# EasyEDA Pro project ProPrj_Volt_Meter_25_3_25_2025-04-11.epro

# Schematic Schematic1

## Sheets
1 P1: Board Name: Board1; Create Date: 2025-03-25; Page Name: P1; Project Name: Volt_Meter_25_3_25; Schematic Name: Schematic1; Update Date: 2025-04-11; Company: 嘉立创EDA; Page Size: A4; Version: V1.0
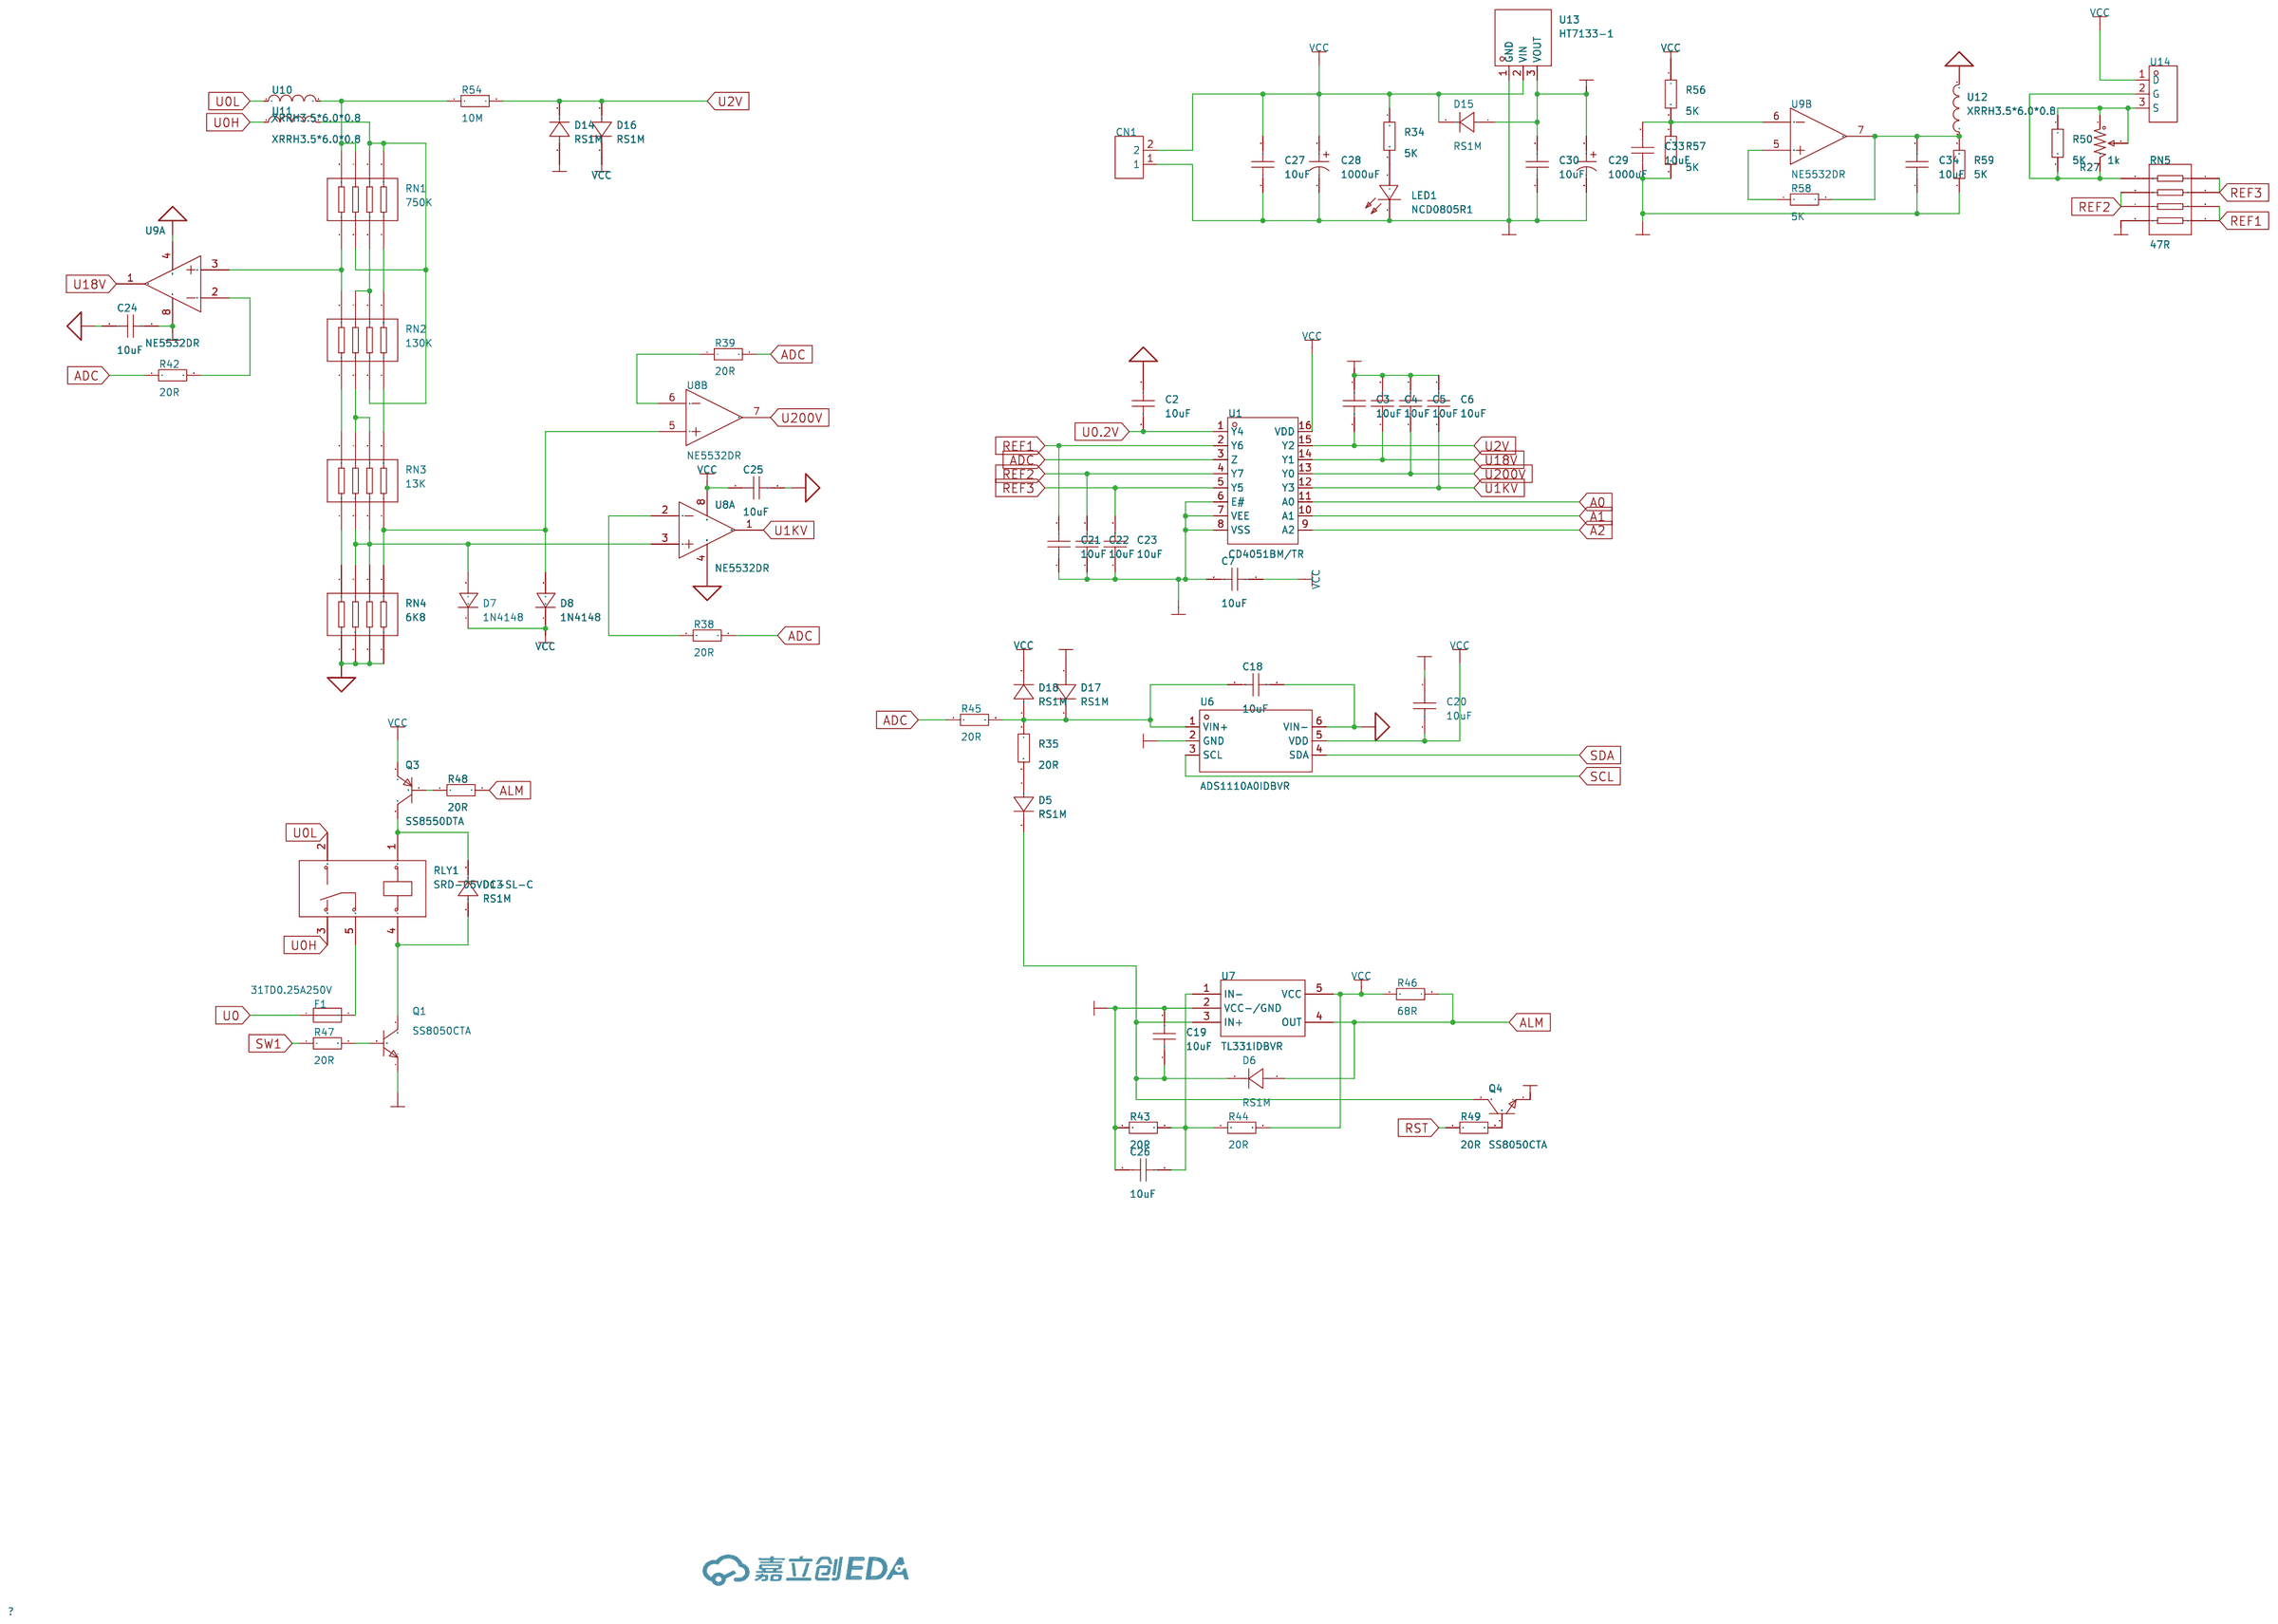
[diagram p0: P1]
2 P2: Page Name: P2; Update Date: 2025-03-26
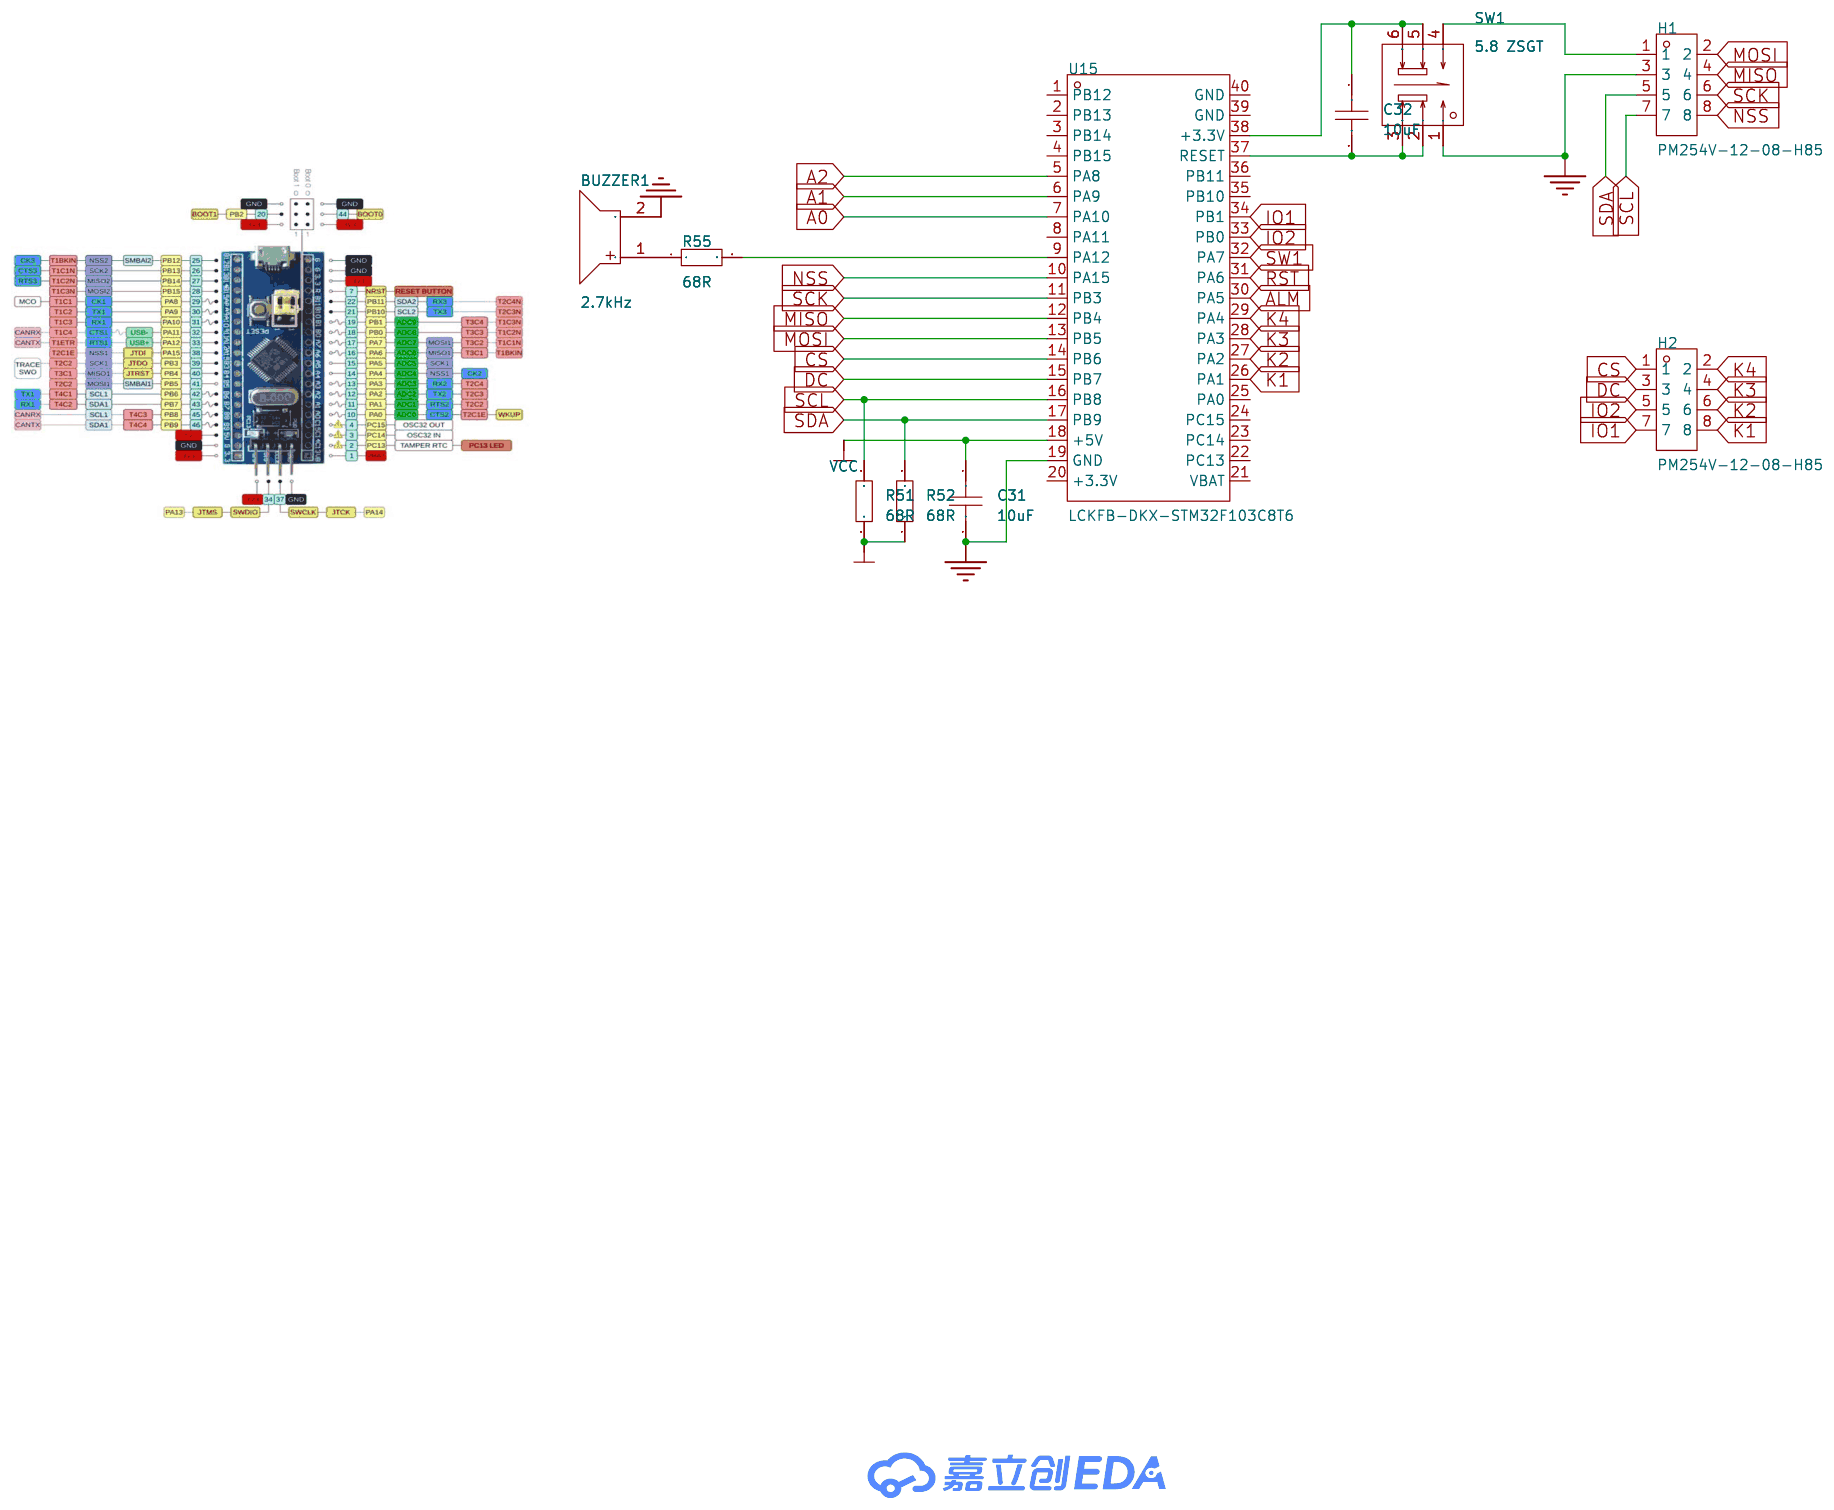
[diagram p1: P2]

## Parts
sheet P1
C2  10uF  [C1206]
C3  10uF  [C1206]
C4  10uF  [C1206]
C5  10uF  [C1206]
C6  10uF  [C1206]
C7  10uF  [C1206]
C18  10uF  [C1206]
C19  10uF  [C1206]
C20  10uF  [C1206]
C21  10uF  [C1206]
C22  10uF  [C1206]
C23  10uF  [C1206]
C24  10uF  [C1206]
C25  10uF  [C1206]
C26  10uF  [C1206]
C27  10uF  [C1206]
C28  1000uF  [CAP-TH_BD10.0-P5.00-D0.6-FD]
C29  1000uF  [CAP-TH_BD10.0-P5.00-D0.6-FD]
C30  10uF  [C1206]
C33  10uF  [C1206]
C34  10uF  [C1206]
CN1  WAFER-XH254Z-2A  [CONN-TH_2P-P2.50_XH-2A_3045048]
D5  RS1M  [SMA_L4.3-W2.6-LS5.2-FD]
D6  RS1M  [SMA_L4.3-W2.6-LS5.2-FD]
D7  1N4148  [DO-35_BD2.0-L4.2-P8.20-D0.5-RD]
D8  1N4148  [DO-35_BD2.0-L4.2-P8.20-D0.5-RD]
D13  RS1M  [SMA_L4.3-W2.6-LS5.2-FD]
D14  RS1M  [SMA_L4.3-W2.6-LS5.2-FD]
D15  RS1M  [SMA_L4.3-W2.6-LS5.2-FD]
D16  RS1M  [SMA_L4.3-W2.6-LS5.2-FD]
D17  RS1M  [SMA_L4.3-W2.6-LS5.2-FD]
D18  RS1M  [SMA_L4.3-W2.6-LS5.2-FD]
F1  31TD0.25A250V  [FUSE-TH_BD4.0-L11.0-P15.00-D0.6]
LED1  NCD0805R1  [LED0805-R-RD]
Q1  SS8050CTA  [TO-92-3_L4.8-W3.7-P2.54-L]
Q3  SS8550DTA  [TO-92-3_L4.8-W3.7-P2.54-L]
Q4  SS8050CTA  [TO-92-3_L4.8-W3.7-P2.54-L]
R27  1k  [rp]
R34  5K  [R1206]
R35  20R  [R1206]
R38  20R  [R1206]
R39  20R  [R1206]
R42  20R  [R1206]
R43  20R  [R1206]
R44  20R  [R1206]
R45  20R  [R1206]
R46  68R  [R1206]
R47  20R  [R1206]
R48  20R  [R1206]
R49  20R  [R1206]
R50  5K  [R1206]
R54  10M  [RES-TH_BD3.3-L9.0-P13.00-D0.6]
R56  5K  [R1206]
R57  5K  [R1206]
R58  5K  [R1206]
R59  5K  [R1206]
RLY1  SRD-05VDC-SL-C  [RELAY-TH_SRD-XXVDC-XL-C]
RN1  750K  [RES-ARRAY-SMD_0603-8P-L3.2-W1.6-BL]
RN2  130K  [RES-ARRAY-SMD_0603-8P-L3.2-W1.6-BL]
RN3  13K  [RES-ARRAY-SMD_0603-8P-L3.2-W1.6-BL]
RN4  6K8  [RES-ARRAY-SMD_0603-8P-L3.2-W1.6-BL]
RN5  47R  [RES-ARRAY-SMD_0603-8P-L3.2-W1.6-BL]
U1  CD4051BM/TR  [SOP-16_L9.9-W3.9-P1.27-LS6.1-BL]
U6  ADS1110A0IDBVR  [SOT-23-6_L2.9-W1.6-P0.95-LS2.8-BR]
U7  TL331IDBVR  [SOT-23-5_L3.0-W1.7-P0.95-LS2.8-BR]
U8  NE5532DR  [SOIC-8_L4.9-W3.9-P1.27-LS6.0-BL]  (sections 1,2)
U9  NE5532DR  [SOIC-8_L4.9-W3.9-P1.27-LS6.0-BL]  (sections 1,2)
U10  XRRH3.5*6.0*0.8  [IND-TH_BD3.5-L6.0-P10.00-D0.8]
U11  XRRH3.5*6.0*0.8  [IND-TH_BD3.5-L6.0-P10.00-D0.8]
U12  XRRH3.5*6.0*0.8  [IND-TH_BD3.5-L6.0-P10.00-D0.8]
U13  HT7133-1  [SOT-89_L4.5-W2.5-P1.50-LS4.2-BR]
U14  J175-D26Z  [TO-92-3_L4.9-W3.7-P2.54-L]
sheet P2
BUZZER1  2.7kHz  [BUZ-TH_BD9.0-P4.00-D0.6-FD]
C31  10uF  [C1206]
C32  10uF  [C1206]
H1  PM254V-12-08-H85  [HDR-TH_8P-P2.54-V-F-R2-C4-S2.54]
H2  PM254V-12-08-H85  [HDR-TH_8P-P2.54-V-F-R2-C4-S2.54]
R51  68R  [R1206]
R52  68R  [R1206]
R55  68R  [R1206]
SW1  5.8 ZSGT  [SW-TH_5.8ZSGT]
U15  LCKFB-DKX-STM32F103C8T6  [CONN-TH_L53.3-W22.9_STM32F103C8T6-CARD]

## Library data of the parts
C2-C7 C18-C23 C26 C27 C30-C34 = HGC1206R5106K500NSPJ: 容值:10uF;精度:±10%;额定电压:50V;温度系数:X5R;; LCSC Part Name: 10uF ±10% 50V; Supplier Part: C7432781; Manufacturer: Chinocera(华瓷); Supplier Footprint: 1206; JLCPCB Part Class: Extended Part; Datasheet: https://atta.szlcsc.com/upload/public/pdf/source/20240320/FAC3FEC40A78BC5CCCE96C232A94D860.pdf; Supplier: LCSC; Tolerance: ±10%; Voltage Rating: 50V; Temperature Coefficient: X5R
C24 C25 = HGC1206R5106K500NSPJ: 容值:10uF;精度:±10%;额定电压:50V;温度系数:X5R;; LCSC Part Name: 10uF ±10% 50V; Supplier Part: C7432781; Manufacturer: Chinocera(华瓷); Supplier Footprint: 1206; JLCPCB Part Class: Extended Part; Datasheet: https://atta.szlcsc.com/upload/public/pdf/source/20240320/FAC3FEC40A78BC5CCCE96C232A94D860.pdf; Supplier: LCSC; Tolerance: ±10%; Voltage Rating: 50V; Temperature Coefficient: X5R; Voltage Rated: 50V
C28 C29 = CD288108M1V1020VFL: 容值:1000uF;额定电压:35V;; LCSC Part Name: 1000uF 35V; Supplier Part: C7499950; Manufacturer: HRK(鸿瑞凯); Supplier Footprint: 插件,D10xL20mm; JLCPCB Part Class: 扩展库; Supplier: LCSC; Rated Voltage: 35V; φD: 10mm; L: 20mm
CN1 = WAFER-XH254Z-2A: 插针结构:1x2P;间距:2.54mm;安装方式:直插;参考系列:XH;总PIN数:2P;排数:1;每排PIN数:2;额定电流:3A;工作温度范围:-25℃~+85℃;; Supplier Part: C7432682; Manufacturer: HANBO(汉博); Supplier Footprint: 插件,P=2.5mm; JLCPCB Part Class: 扩展库; Datasheet: https://atta.szlcsc.com/upload/public/pdf/source/20230718/3B4FABA5D38EFB02DAF74E7C2B33D98F.pdf; Supplier: LCSC; Pins Structure: 1x2P; Pitch: 2.54mm; Mounting Style: 直插; Reference Series: XH; Number of Pins: 2P; Number of Rows: 1; Number of PINs Per Row: 2; Current Rating (Max): 3A; Operating Temperature Range: -25℃~+85℃
D5 D6 D13-D18 = RS1M_C84573: 二极管配置:-;正向压降(Vf):1.3V@1A;直流反向耐压(Vr):1kV;平均整流电流(Io):1A;反向恢复时间(trr):500ns;; LCSC Part Name: 电压:1kV 电流:1A; Supplier Part: C84573; Manufacturer: onsemi(安森美); Supplier Footprint: SMA(DO-214AC); JLCPCB Part Class: Extended Part; Datasheet: https://atta.szlcsc.com/upload/public/pdf/source/20221020/37CD5E236AEBE8986458C591B9789D62.pdf; Supplier: LCSC; Forward Voltage (Vf@If): 1.3V@1A; Reverse Voltage (Vr): 1kV; Average Rectified Current (Io): 1A; Reverse Leakage Current: 5uA@1kV; Reverse Recovery Time (trr): 500ns; Operating Temperature: -55℃~+150℃
D7 D8 = 1N4148_C402212: 二极管配置:-;正向压降(Vf):1V@10mA;直流反向耐压(Vr):75V;整流电流:150mA;反向恢复时间(Trr):4ns;; Supplier Part: C402212; Manufacturer: LGE(鲁光); Supplier Footprint: DO-35; JLCPCB Part Class: 扩展库; Datasheet: https://atta.szlcsc.com/upload/public/pdf/source/20190705/C402212_D6CD0A8EA8714742E0940C7C02C37BFA.pdf; Supplier: LCSC; Voltage - Forward(Vf@If): 1V@10mA; Voltage - DC Reverse(Vr): 75V; Current - Rectified: 150mA; Reverse Leakage Current (Ir): 5uA@75V; Reverse Recovery Time (trr): 4ns
F1 = 31TD3.15A250V: 类型:玻璃管保险丝;额定电流:3.15A;; LCSC Part Name: 玻璃管保险丝; Supplier Part: C529611; Manufacturer: Hongda(泓达); Supplier Footprint: 插件,3.6x10mm; JLCPCB Part Class: 扩展库; Datasheet: https://atta.szlcsc.com/upload/public/pdf/source/20200925/C529598_C15F8C787D72EA14793E531535459612.pdf; Supplier: LCSC; Type: 玻璃管保险丝; Current Rating: 3.15A
LED1 = NCD0805R1: 灯头类型:-;发光颜色:红色;正向电压(VF):1.6V~2.6V;功率:65mW;正向电流:20mA;主波长:615nm~630nm;二极管配置:独立二极管;透镜颜色:无色透明透镜;色温:-;发光强度:67mcd~195mcd;发光角度:130°;载带方式:-;工作温度:-30℃~+85℃;; Supplier Part: C84256; Manufacturer: 国星光电; Supplier Footprint: 0805; JLCPCB Part Class: 基础库; Datasheet: https://atta.szlcsc.com/upload/public/pdf/source/20200820/C84256_F0A75A43B3EAD75808600A0514C76B99.pdf; Supplier: LCSC; Emitted Color: 红色; Forward Voltage (VF): 1.6V~2.6V; Power Dissipation: 65mW; Forward Current: 20mA; Dominant Wavelength: 615nm~630nm; Diode Configuration: 独立二极管; Lens Color: 无色透明透镜; Luminous Intensity: 67mcd~195mcd; Viewing Angle: 130°; Operating Temperature: -30℃~+85℃
Q1 Q4 = SS8050CTA: 晶体管类型:NPN;集电极电流(Ic):1.5A;集射极击穿电压(Vceo):25V;功率(Pd):1W;直流电流增益(hFE@Ic,Vce):45@5mA,1V;; LCSC Part Name: NPN 电流:1.5A 耐压:25V; Supplier Part: C327517; Manufacturer: onsemi(安森美); Supplier Footprint: TO-92-3; JLCPCB Part Class: Extended Part; Datasheet: https://atta.szlcsc.com/upload/public/pdf/source/20181108/C327517_CA6FA84C2D2031BB33923FFD20F34E98.pdf; Supplier: LCSC; Transistor Type: NPN; Collector Current (Ic): 1.5A; Collector-Emitter Breakdown Voltage (Vceo): 25V; Power Dissipation (Pd): 1W; DC Current Gain (hFE@Ic,Vce): 45@5mA,1V; Transition Frequency (fT): 100MHz; Collector Cut-Off Current (Icbo): 100nA; Collector-Emitter Saturation Voltage (VCE(sat)@Ic,Ib): 500mV@800mA,80mA; Operating Temperature: -150℃~+150℃
Q3 = SS8550DTA: 晶体管类型:PNP;集电极电流(Ic):1.5A;集射极击穿电压(Vceo):25V;功率(Pd):2W;直流电流增益(hFE@Ic,Vce):40@800mA,1V;; LCSC Part Name: PNP 电流:1.5A 耐压:25V; Supplier Part: C903228; Manufacturer: onsemi(安森美); Supplier Footprint: TO-92-3; JLCPCB Part Class: Extended Part; Datasheet: https://atta.szlcsc.com/upload/public/pdf/source/20221020/9DBCD1C6A257D06DE4F9043ED0140297.pdf; Supplier: LCSC; Transistor Type: PNP; Collector Current (Ic): 1.5A; Collector-Emitter Breakdown Voltage (Vceo): 25V; Power Dissipation (Pd): 2W; DC Current Gain (hFE@Ic,Vce): 40@800mA,1V; Transition Frequency (fT): 100MHz; Collector Cut-Off Current (Icbo): 100nA; Collector-Emitter Saturation Voltage (VCE(sat)@Ic,Ib): 280mV@800mA,80mA; Operating Temperature: -65℃~+150℃
R27 = RM065-103(10K): 阻值:10kΩ;精度:±25%;功率:100mW;; LCSC Part Name: 10kΩ ±25%; Supplier Part: C5205021; Manufacturer: BOCHEN(博晨); Supplier Footprint: 插件; JLCPCB Part Class: 扩展库; Datasheet: https://atta.szlcsc.com/upload/public/pdf/source/20221019/6263C46FBC7F1B66CBAADA74DC5EFAA2.pdf; Supplier: LCSC; Tolerance: ±25%; Power(Watts): 100mW
R34 R35 R38 R39 R42-R52 R55-R59 = 1206W4F4701T5E: 电阻类型:厚膜电阻;阻值:4.7kΩ;精度:±1%;功率:250mW;最大工作电压:200V;温度系数:±100ppm/℃;; LCSC Part Name: 4.7kΩ ±1% 250mW 厚膜电阻; Supplier Part: C17936; Manufacturer: UNI-ROYAL(厚声); Supplier Footprint: 1206; JLCPCB Part Class: 基础库; Datasheet: https://atta.szlcsc.com/upload/public/pdf/source/20200306/C422600_1E6D84923E4A46A82E41ADD87F860B5C.pdf; Supplier: LCSC; Type: 厚膜电阻; Tolerance: ±1%; Power(Watts): 250mW; Overload Voltage (Max): 200V; Temperature Coefficient: ±100ppm/℃; Operating Temperature Range: -55℃~+155℃
R54 = RN1WS15KΩFT/BA1: 电阻类型:金属膜电阻;阻值:15kΩ;精度:±1%;功率:1W;温度系数:±50ppm/℃;; LCSC Part Name: 15kΩ ±1% 1W 金属膜电阻; Supplier Part: C385283; Manufacturer: Tyohm(幸亚电阻); Supplier Footprint: 插件,D3.3xL9.2mm; JLCPCB Part Class: 扩展库; Datasheet: https://atta.szlcsc.com/upload/public/pdf/source/20191008/C433681_B72693A7FD256E0D1DC5EFE3F095EED3.pdf; Supplier: LCSC; Type: 金属膜电阻; Tolerance: ±1%; Power(Watts): 1W; Temperature Coefficient: ±50ppm/℃
RLY1 = SRD-05VDC-SL-C: 线圈电压:5V;触点形式:一组转换:1C(单刀双掷-转换);触点容量(电阻负载):-;最大切换电压:250V@AC;最大切换电流:15A;; LCSC Part Name: 蓝色; Supplier Part: C35449; Manufacturer: 松乐; Supplier Footprint: 插件,15.6x19.2mm; JLCPCB Part Class: 扩展库; Datasheet: https://atta.szlcsc.com/upload/public/pdf/source/20200305/C490149_C96E4098A3B1FFB377D5AD2E40B7C2A8.pdf; Supplier: LCSC; Coil Voltage: 5V; Contact Form: 一组转换:1C(单刀双掷-转换); Pin Number: 5; Maximum Switching Voltage: 250V@AC; Coil Rated Power: 360mW; Maximum Switching Current: 15A; Coil Type: 无极性-单线圈; Coil Resistance: 70Ω; Contact Resistance: 100mΩ; Operate Time: 10ms; Release Time: 10ms
RN1-RN5 = 4D03WGJ0103T5E: 电阻器数:4;阻值:10kΩ;精度:±5%;单个元件功率:62.5mW;温度系数:±200ppm/℃;; LCSC Part Name: 10kΩ ±5%; Supplier Part: C29718; Manufacturer: UNI-ROYAL(厚声); Supplier Footprint: 0603x4; JLCPCB Part Class: Basic Part; Datasheet: https://atta.szlcsc.com/upload/public/pdf/source/20191224/C474318_2527498AE30E813171187CCD28401A71.pdf; Supplier: LCSC; Number of Resistors: 4; Tolerance: ±5%; Power(Watts): 62.5mW; Temperature Coefficient: ±200ppm/℃; Number of Pins: 8
U1 = CD4051BM/TR: 开关电路:单刀八掷(SP8T);通道数:8;导通电阻(Ron@VCC):60Ω;; LCSC Part Name: CD4051B 单刀八掷模拟开关; Supplier Part: C507163; Manufacturer: HGSEMI(华冠); Supplier Footprint: SOP-16; JLCPCB Part Class: Extended Part; Datasheet: https://atta.szlcsc.com/upload/public/pdf/source/20240320/7BB009024CA6631C42E25AC5CB4174DD.pdf; Supplier: LCSC; Switch Circuit: 单刀八掷(SP8T); Number of Channels: 8; Supply Voltage: 3V~15V; On-State Resistance (Max): 60Ω; Operating Temperature: -40℃~+85℃
U6 = ADS1110A0IDBVR: 接口:I2C;电源电压:2.7V~5.5V;采样率:240Hz;分辨率:16位;; Supplier Part: C16598; Manufacturer: TI(德州仪器); Supplier Footprint: SOT-23-6; JLCPCB Part Class: Extended Part; Datasheet: http://www.ti.com/cn/lit/gpn/ads1110; Supplier: LCSC; Interface: I2C; differential input: 是; number of channels: 1; Supply Voltage: 2.7V~5.5V; sampling frequency: 240Hz; resolution: 16位; Operating Temperature: -40℃~+125℃
U7 = TL331IDBVR: 输入失调电压(Vos):5mV;输入偏置电流(Ib):250nA;轨到轨:-;; LCSC Part Name: 单通道差分比较器; Supplier Part: C80942; Manufacturer: TI(德州仪器); Supplier Footprint: SOT-23-5; JLCPCB Part Class: Extended Part; Datasheet: https://www.ti.com/cn/lit/gpn/tl331; Supplier: LCSC; Input Offset Voltage (Vos): 5mV; Input Bias Current (Ib): 250nA; Supply Voltage: 1V~18V；2V~36V; Output Type: 开集; Supply Current: 700uA; Operating Temperature: -40℃~+85℃
U8 U9 = NE5532DR: 放大器数:双路;增益带宽积(GBP):10MHz;输入偏置电流(Ib):200nA;压摆率(SR):9V/us;带宽(-3db):-;; Supplier Part: C7426; Manufacturer: TI(德州仪器); Supplier Footprint: SOIC-8; JLCPCB Part Class: 基础库; Datasheet: http://www.ti.com/cn/lit/gpn/ne5532; Supplier: LCSC; Number of Circuits: 双路; Gain Bandwidth Product(GBP): 10MHz; Current - Input Bias(Ib): 200nA; Slew Rate(SR): 9V/us; Output Current: 38mA; Supply Current: 8mA; Operating Temperature: 0℃~+70℃
U10-U12 = XRRH3.5*6.0*0.8: 标称阻抗@测试频率:60Ω@100MHz;; LCSC Part Name: 60Ω@100MHz 3.5x6.0x0.8孔磁珠; Supplier Part: C5339819; Manufacturer: XR(祥如); Supplier Footprint: DIP,3.5x6x0.8; JLCPCB Part Class: 扩展库; Datasheet: https://atta.szlcsc.com/upload/public/pdf/source/20221228/76E95282014C08825AC24029845E2C2D.pdf; Supplier: LCSC; Impedance @ Frequency: 60Ω@100MHz; Circuits: 1
U13 = HT7133-1_C347181: 输出类型:固定;最大输入电压:30V;输出电压:3.3V;输出电流:100mA;电源纹波抑制比(PSRR):-;输出极性:正极;; LCSC Part Name: 输入30V 输出3.3V 100mA; Supplier Part: C347181; Manufacturer: UMW(友台半导体); Supplier Footprint: SOT-89; JLCPCB Part Class: 扩展库; Datasheet: https://atta.szlcsc.com/upload/public/pdf/source/20241113/93F7C18DFD850690D44F7CF6D98374DA.pdf; Supplier: LCSC; Output Type: 固定; Maximum Input Voltage: 30V; Output Voltage: 3.3V; Output Current: 100mA; Dropout Voltage: 100mV@(1mA); standby current: 3uA; Operating Temperature: -20℃~+70℃; Output Polarity: 正极; Number of Outputs: 1
U14 = J175-D26Z: FET类型:P沟道;栅源击穿电压(V(BR)GSS):30V;功率(Pd):350mW;漏源导通电阻(RDS(on)):125Ω;饱和漏源电流(Idss@Vds,Vgs=0):7mA@15V;; Supplier Part: C900948; Manufacturer: onsemi(安森美); Supplier Footprint: TO-92-3; JLCPCB Part Class: 扩展库; Datasheet: https://atta.szlcsc.com/upload/public/pdf/source/20210715/C900949_DB34870F1CE3DCA36365F4A26860CC8F.pdf; Supplier: LCSC; FET Type: P沟道; Gate-Source Cutoff Voltage (VGS(off)@ID): 3V@10nA; Gate-Source Breakdown Voltage (V(BR)GSS): 30V; Total Device Dissipation (Pd): 350mW; Static Drain-Source On Resistance (RDS(on)): 125Ω; Drain Current (Idss@Vds,Vgs=0): 7mA@15V; Operating Temperature: -55℃~+150℃@(Tj)
BUZZER1 = QMB-09B-03: 驱动方式:无源(外部驱动);构造类型:电磁式;频率:2.7kHz;声压(SPL):85dB;; LCSC Part Name: 无源蜂鸣器QMB-09B-03; Supplier Part: C96256; Manufacturer: 华能; Supplier Footprint: 插件,D=9mm; JLCPCB Part Class: 扩展库; Datasheet: https://atta.szlcsc.com/upload/public/pdf/source/20210401/C96256_958B17753B5AD7CBFBCFFC7C095B4484.pdf; Supplier: LCSC; Driver Circuitry: 无源(外部驱动); Technology: 电磁式; Voltage - Supply: 2V~5V; Sound Pressure Level(SPL): 85dB; Diameter(φD): 9mm; Height: 5.7mm
H1 H2 = PM254V-12-08-H85: 插孔结构:2x4P;间距:2.54mm;行距:2.54mm;圆孔/方孔:方孔;安装类型:直插;排数:双排;总孔位数:8P;额定电流:3A;额定电压:250V;插孔方向:顶部;塑高:8.5mm;工作温度范围:-40℃~+105℃;; LCSC Part Name: 间距:2.54mm 2x4P 直插; Supplier Part: C2834799; Manufacturer: XFCN(兴飞); Supplier Footprint: 插件,P=2.54mm; JLCPCB Part Class: 扩展库; Datasheet: https://atta.szlcsc.com/upload/public/pdf/source/20200309/C492399_8C441E2934FBB604A89B37A68AA45ECF.pdf; Supplier: LCSC; Holes Structure: 2x4P; Pitch: 2.54mm; Row Spacing: 2.54mm; Circular Hole / Square Hole: 方孔; Mounting Type: 直插; Number of Rows: 双排; Number of Holes: 8P; Current Rating (Max): 3A; Voltage Rating (Max): 250V; Holes Direction: 顶部; Insulation Height: 8.5mm; Operating Temperature Range: -40℃~+105℃
SW1 = 5.8 ZSGT: 电路结构:双刀双掷;自锁/无锁:自锁;安装方式:直插;触点电流:110mA;额定电压 (DC):30V;带灯:不带;作用力:1.5N;机械寿命:10万次;; LCSC Part Name: 5.8*5.8有头/高头 带锁/自锁开关 泡泡机开关; Supplier Part: C2681587; Manufacturer: SHOU HAN(首韩); Supplier Footprint: 插件; JLCPCB Part Class: 扩展库; Datasheet: https://atta.szlcsc.com/upload/public/pdf/source/20210107/C2681587_CDDDDA4A1C7AC9FEB01815B75893A6BA.pdf; Supplier: LCSC; Circuit: 双刀双掷; Self Lock / No Lock: 自锁; Actuator Style: 方形按钮; Mounting Style: 直插; Contact Current: 110mA; Voltage Rating (DC): 30V; Insulation Resistance: 100MΩ; Actuator/Cap Color: 白色; With Lamp: 不带; Pin Style: PC引脚; Operating Force: 1.5N; Operating Temperature: -10℃~+70℃; Mechanical Life: 10万次
U15 = LCKFB-DKX-STM32F103C8T6: LCSC Part Name: 立创·地阔星-STM32F103C8T6开发板; Supplier Part: C22396880; Manufacturer: 立创开发板; JLCPCB Part Class: 扩展库; Datasheet: https://atta.szlcsc.com/upload/public/pdf/source/20240801/7EEF69F7480DF7C6DA98696664D658D4.pdf; Supplier: LCSC

## Nets
3V3: C24.1 C29.1 C30.2 D15.1(A) R51.2 R52.1 U9.8(VCC+) U13.3(VOUT)
AGND: C2.2 C18.1 C24.2 C25.2 RN4.1 RN4.2 RN4.3 RN4.4 U6.6(VIN-) U8.4(VCC-/GND) U9.4(VCC-/GND) U12.2
GND: BUZZER1.2 C31.2 H1.3 SW1.1 U15.19(GND)
VCC: C7.1 C20.2 C25.1 C27.2 C28.1 C31.1 CN1.2 D7.1(C) D8.1(C) D15.2(K) D16.2(K) D18.2(K) Q3.1(E) R34.1 R44.2 R46.1 R56.1 U1.16(VDD) U6.5(VDD) U7.5(VCC) U8.8(VCC+) U13.2(VIN) U14.1(D) U15.18(+5V)
VEE: C3.2 C4.2 C5.2 C6.2 C7.2 C19.2 C20.1 C21.1 C22.1 C23.1 C26.2 C27.1 C28.2 C29.2 C30.1 C33.1 C34.1 CN1.1 D14.1(A) D17.1(A) LED1.2(-) Q1.1(E) Q4.1(E) R43.1 R57.2 R59.1 RN5.8 U1.6(E#) U1.7(VEE) U1.8(VSS) U6.2(GND) U7.2(VCC-/GND) U13.1(GND)
A0: U1.11(A0) U15.7(PA10)
A1: U1.10(A1) U15.6(PA9)
A2: U1.9(A2) U15.5(PA8)
ADC: R38.2 R39.2 R42.1 R45.1 U1.3(Z)
ALM: D6.1(A) R46.2 R48.2 U7.4(OUT) U15.30(PA5)
CS: H2.1 U15.14(PB6)
DC: H2.3 U15.15(PB7)
IO1: H2.7 U15.34(PB1)
IO2: H2.5 U15.33(PB0)
K1: H2.8 U15.26(PA1)
K2: H2.6 U15.27(PA2)
K3: H2.4 U15.28(PA3)
K4: H2.2 U15.29(PA4)
MISO: H1.4 U15.12(PB4)
MOSI: H1.2 U15.13(PB5)
NSS: H1.8 U15.10(PA15)
REF1: C21.2 RN5.1 RN5.2 U1.2(Y6)
REF2: C22.2 RN5.6 RN5.7 U1.4(Y7)
REF3: C23.2 RN5.3 RN5.4 U1.5(Y5)
RST: R49.1 U15.31(PA6)
SCK: H1.6 U15.11(PB3)
SCL: H1.7 R51.1 U6.3(SCL) U15.16(PB8)
SDA: H1.5 R52.2 U6.4(SDA) U15.17(PB9)
SW1: R47.1 U15.32(PA7)
U0: F1.1
U0.2V: C2.1 U1.1(Y4)
U0H: RLY1.3 U11.1
U0L: RLY1.2 U10.1
U1KV: C6.1 U1.12(Y3) U8.1(OUT1)
U2V: C3.1 D14.2(K) D16.1(A) R54.2 U1.15(Y2)
U18V: C4.1 U1.14(Y1) U9.1(OUT1)
U200V: C5.1 U1.13(Y0) U8.7(OUT2)
$1N505: R54.1 RN1.7 RN1.8 U10.2
$1N521: RN1.1 RN2.8 U9.3(IN1+)
$1N526: RN2.1 RN3.8
$1N531: RN3.1 RN4.8
$1N597: RN1.3 RN2.6 RN2.7
$1N641: RN2.2 RN3.6 RN3.7
$1N657: D7.2(A) RN3.2 RN3.3 RN4.6 RN4.7 U8.3(IN1+)
$1N3462: LED1.1(+) R34.2
$1N3974: C18.2 D17.2(K) D18.1(A) R35.1 R45.2 U6.1(VIN+)
$1N4255: C26.1 R43.2 R44.1 U7.1(IN-)
$1N4346: C19.1 D5.2(K) D6.2(K) Q4.3(C) U7.3(IN+)
$1N4350: D5.1(A) R35.2
$1N6459: R38.1 U8.2(IN1-)
$1N7638: RN2.4 RN3.5
$1N7643: D8.2(A) RN3.4 RN4.5 U8.5(IN2+)
$1N8146: RN1.2 RN1.5 RN1.6 RN2.3 U11.2
$1N8415: R39.1 U8.6(IN2-)
$1N9981: R42.2 U9.2(IN1-)
$1N10799: F1.2 RLY1.5
$1N10825: D13.2(K) Q3.3(C) RLY1.1
$1N10878: D13.1(A) Q1.3(C) RLY1.4
$1N11007: Q1.2(B) R47.2
$1N11274: Q3.2(B) R48.1
$1N14065: Q4.2(B) R49.2
$1N14293: R27.1 R27.2 R50.1 U14.3(S)
$1N14359: R27.3 R50.2 RN5.5 U14.2(G)
$1N20447: RN1.4 RN2.5
$1N20738: C33.2 R56.2 R57.1 U9.6(IN2-)
$1N20855: C34.2 R58.2 R59.2 U9.7(OUT2) U12.1
$1N20860: R58.1 U9.5(IN2+)
$2N1148: C32.2 SW1.2 SW1.3 U15.37(RESET)
$2N1181: C32.1 SW1.5 SW1.6 U15.38(+3.3V)
$2N1189: H1.1 SW1.4
$2N1791: BUZZER1.1 R55.1
$2N1795: R55.2 U15.9(PA12)

Not connected (* = marked no-connect by the designer): U15 1(PB12) 2(PB13) 3(PB14) 4(PB15) 8(PA11) 20(+3.3V) 21(VBAT) 22(PC13) 23(PC14) 24(PC15) 25(PA0) 35(PB10) 36(PB11) 39(GND) 40(GND)

# Board PCB1
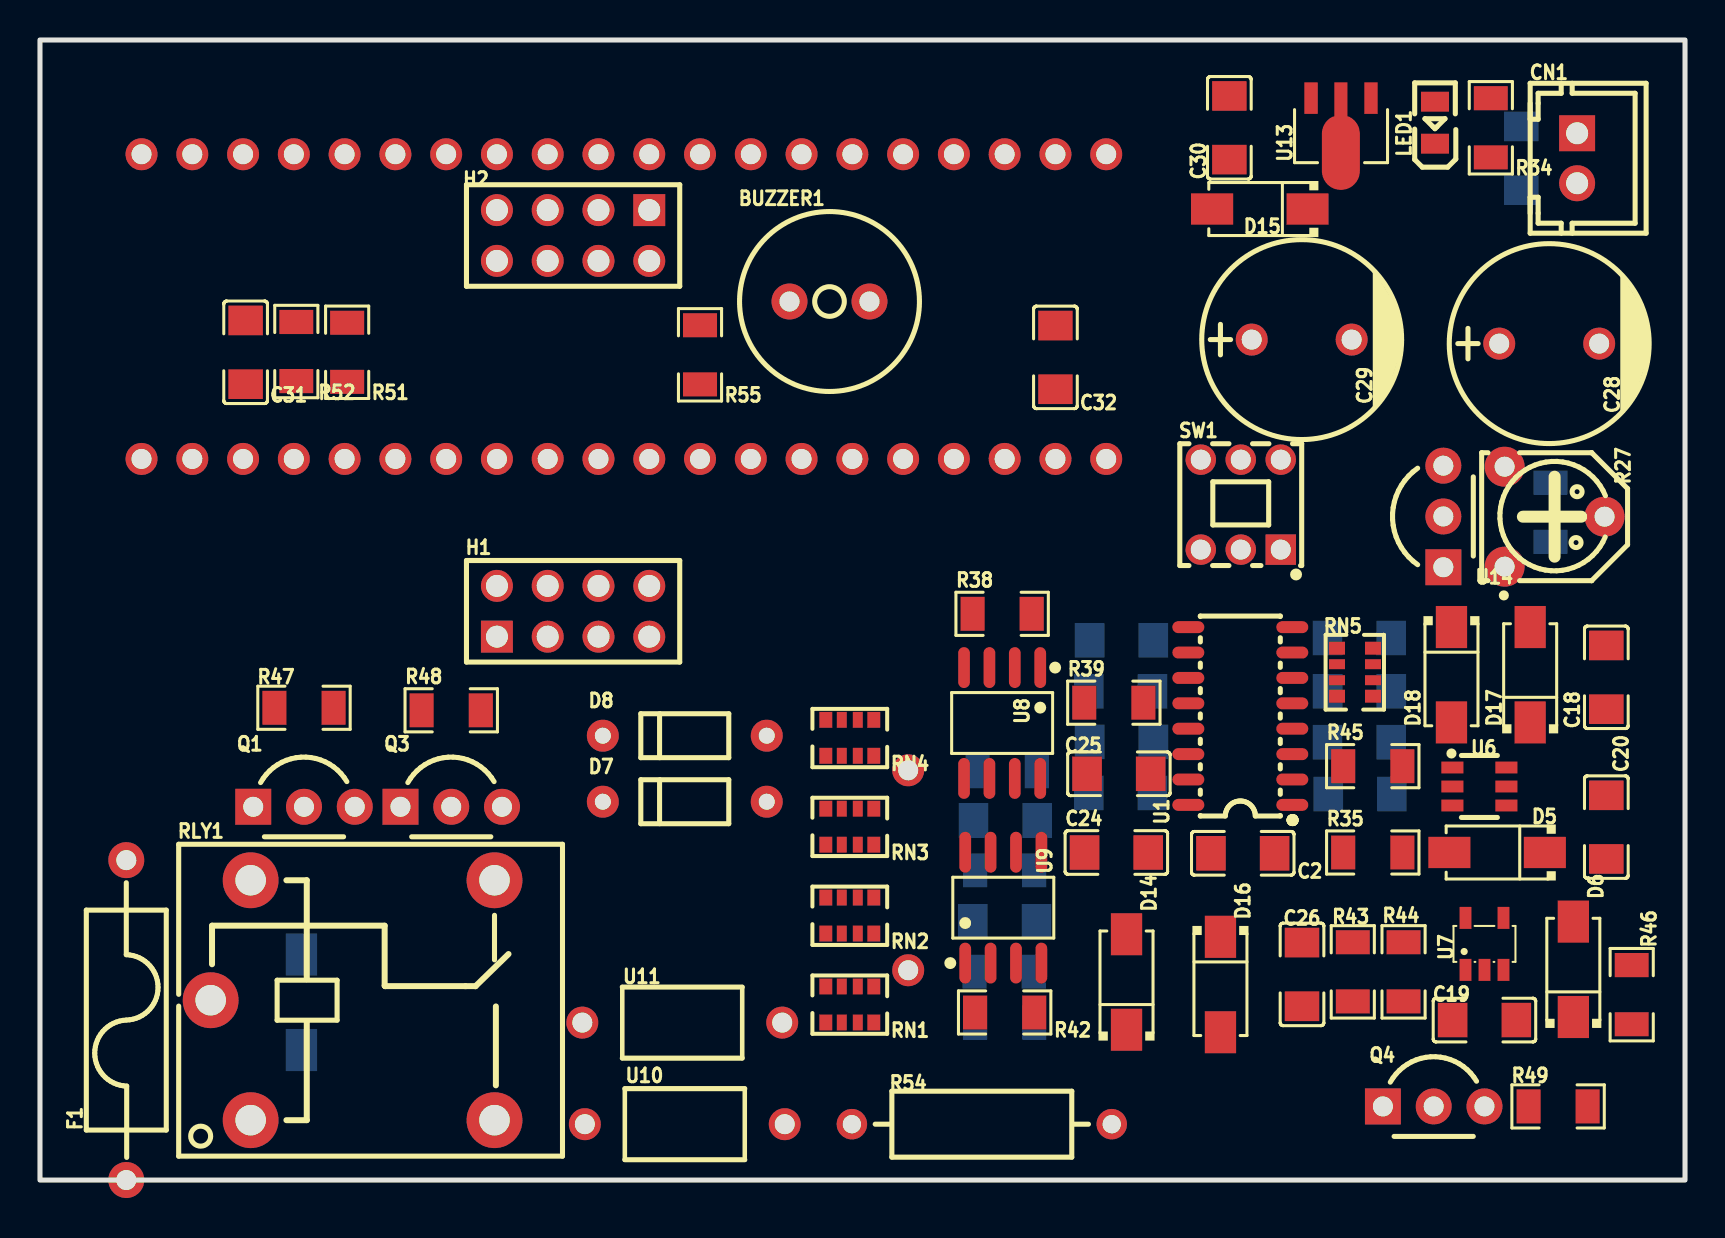
[diagram p2: board, top side]
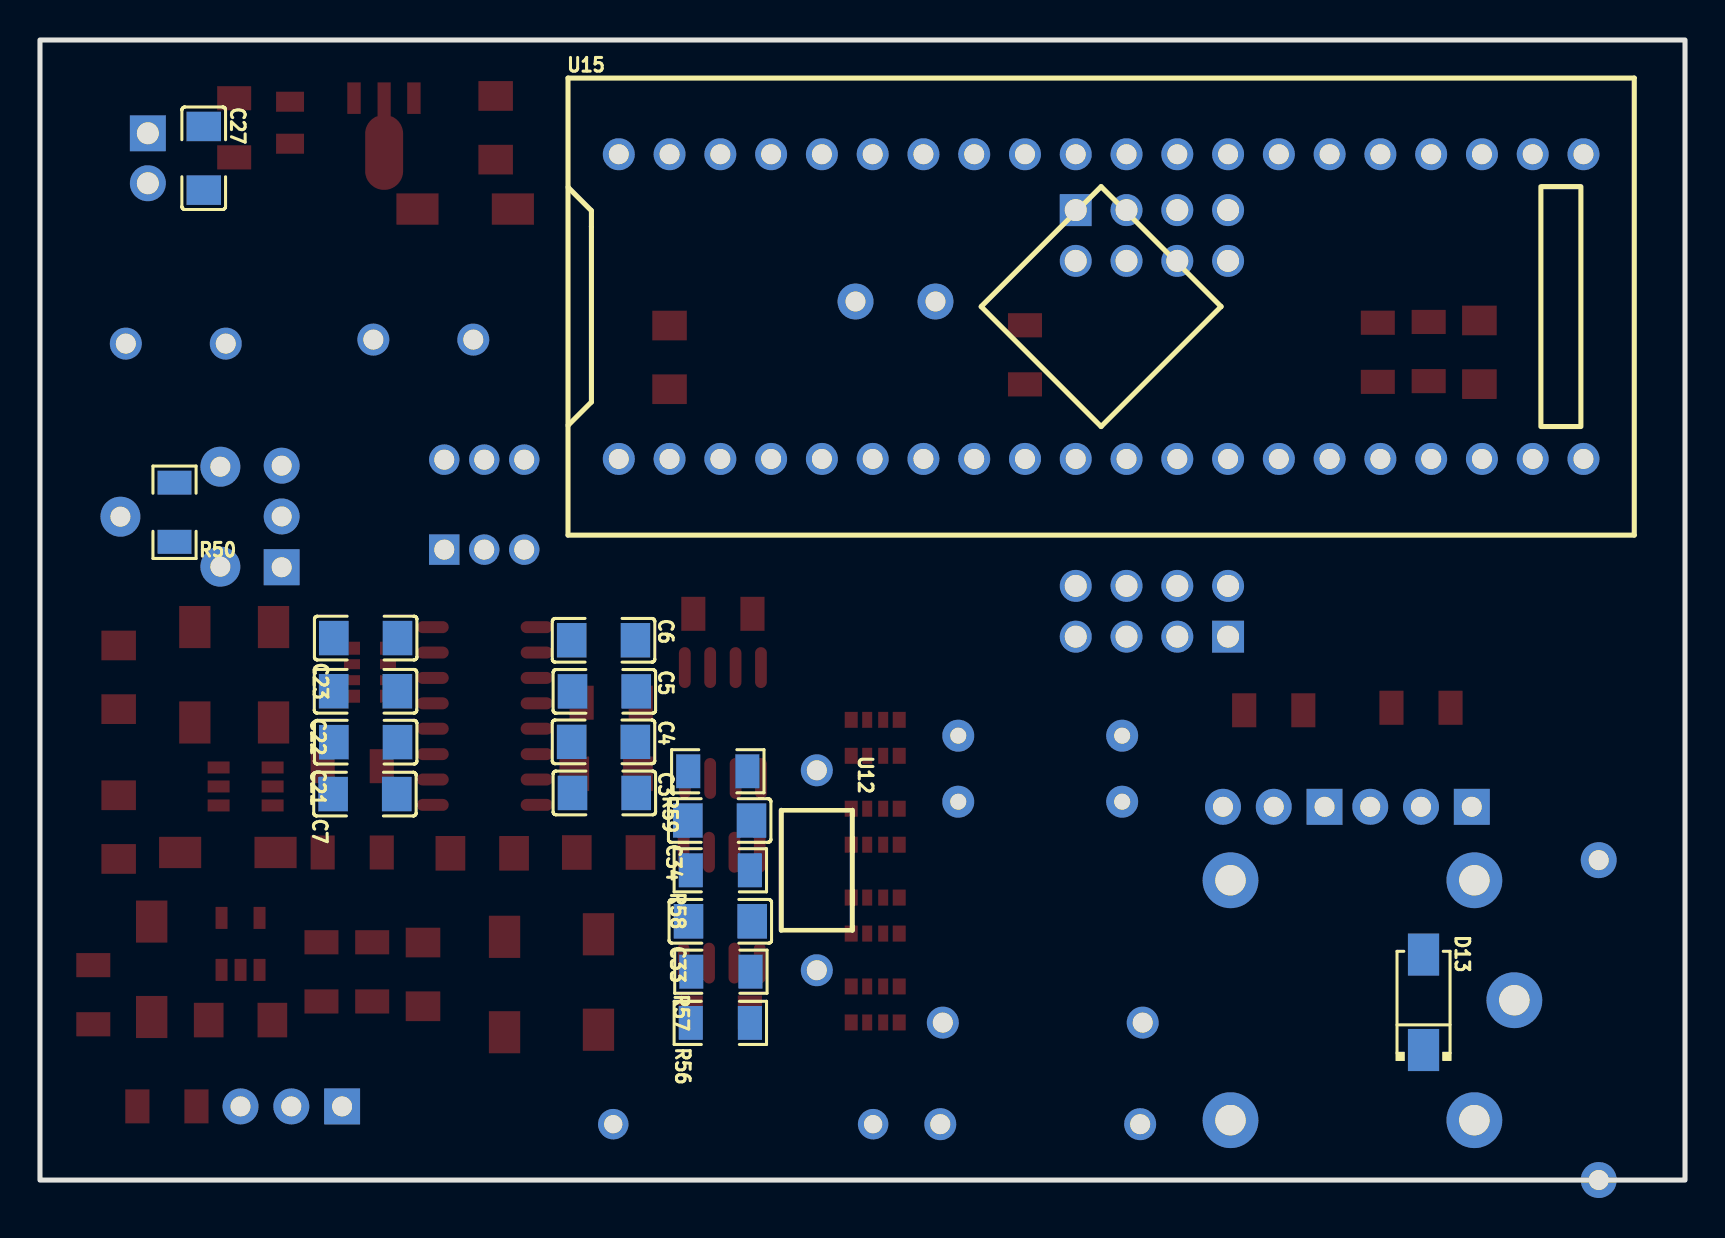
[diagram p3: board, bottom side, seen from below]

Outline 82.3 x 57.02 mm; copper layers: Top Layer, Bottom Layer. Coordinates in mm from the lower left corner of the outline.
Outline path: rectangle 0,57.02 82.3,0
Stack: Top Layer 0.035mm / Dielectric1 1.51mm FR4 er 4.5 / Bottom Layer 0.035mm

## Design rules (mm)
template: JLCPCB Capability(Two Layers Board)
spacing copperThickness1oz (default): track to track 0.102, other pairs 0.152 to 0.3
spacing copperThickness2oz: track to track 0.203, other pairs 0.152 to 0.3
track width copperThickness1oz (default): min 0.127, default 0.254, max 2.54
track width copperThickness2oz: min 0.203, default 0.254, max 2.54
differential pair differentialPair (default): width min 0.127, default 0.254, max 2.54; gap min 0.152, default 0.152
via viaSize (default): diameter min 0.5, default 0.61, max 10; hole min 0.3, default 0.305, max 6.3

## Placement (name value [footprint] x y rotation side)
BUZZER1  2.7kHz  [BUZ-TH_BD9.0-P4.00-D0.6-FD]  39.5 43.94 0 top
C2  10uF  [C1206]  60.17 16.34 180 top
C3  10uF  [C1206]  54.06 19.36 180 bottom
C4  10uF  [C1206]  54.1 21.92 180 bottom
C5  10uF  [C1206]  54.06 24.44 180 bottom
C6  10uF  [C1206]  54.1 27 180 bottom
C7  10uF  [C1206]  66.04 19.3 0 bottom
C18  10uF  [C1206]  78.36 25.15 90 top
C19  10uF  [C1206]  72.26 8 180 top
C20  10uF  [C1206]  78.36 17.65 90 top
C21  10uF  [C1206]  66 21.9 180 bottom
C22  10uF  [C1206]  66.01 24.45 180 bottom
C23  10uF  [C1206]  66 27.11 180 bottom
C24  10uF  [C1206]  53.85 16.38 0 top
C25  10uF  [C1206]  53.97 20.32 0 top
C26  10uF  [C1206]  63.14 10.29 90 top
C27  10uF  [C1206]  74.1 51.11 270 bottom
C28  1000uF  [CAP-TH_BD10.0-P5.00-D0.6-FD]  75.5 41.84 0 top
C29  1000uF  [CAP-TH_BD10.0-P5.00-D0.6-FD]  63.12 42.04 0 top
C30  10uF  [C1206]  59.5 52.63 270 top
C31  10uF  [C1206]  10.29 41.4 270 top
C32  10uF  [C1206]  50.8 41.15 270 top
C33  10uF  [C1206]  48.26 12.94 180 bottom
C34  10uF  [C1206]  48.29 17.98 180 bottom
CN1  WAFER-XH254Z-2A  [CONN-TH_2P-P2.50_XH-2A_3045048]  76.9 51.11 270 top
D5  RS1M  [SMA_L4.3-W2.6-LS5.2-FD]  72.9 16.38 0 top
D6  RS1M  [SMA_L4.3-W2.6-LS5.2-FD]  76.71 10.54 270 top
D7  1N4148  [DO-35_BD2.0-L4.2-P8.20-D0.5-RD]  32.26 18.92 0 top
D8  1N4148  [DO-35_BD2.0-L4.2-P8.20-D0.5-RD]  32.26 22.23 0 top
D13  RS1M  [SMA_L4.3-W2.6-LS5.2-FD]  13.08 8.89 270 bottom
D14  RS1M  [SMA_L4.3-W2.6-LS5.2-FD]  54.36 9.91 270 top
D15  RS1M  [SMA_L4.3-W2.6-LS5.2-FD]  61.02 48.57 0 top
D16  RS1M  [SMA_L4.3-W2.6-LS5.2-FD]  59.06 9.78 90 top
D17  RS1M  [SMA_L4.3-W2.6-LS5.2-FD]  74.55 25.27 270 top
D18  RS1M  [SMA_L4.3-W2.6-LS5.2-FD]  70.61 25.27 90 top
F1  31TD0.25A250V  [FUSE-TH_BD4.0-L11.0-P15.00-D0.6]  4.32 8 90 top
H1  PM254V-12-08-H85  [HDR-TH_8P-P2.54-V-F-R2-C4-S2.54]  26.67 28.45 0 top
H2  PM254V-12-08-H85  [HDR-TH_8P-P2.54-V-F-R2-C4-S2.54]  26.67 47.24 180 top
LED1  NCD0805R1  [LED0805-R-RD]  69.79 52.89 90 top
Q1  SS8050CTA  [TO-92-3_L4.8-W3.7-P2.54-L]  13.21 18.67 0 top
Q3  SS8550DTA  [TO-92-3_L4.8-W3.7-P2.54-L]  20.57 18.67 0 top
Q4  SS8050CTA  [TO-92-3_L4.8-W3.7-P2.54-L]  69.72 3.68 0 top
R27  1k  [rp]  75.77 33.18 270 top
R34  5K  [R1206]  72.58 52.63 90 top
R35  20R  [R1206]  66.67 16.38 0 top
R38  20R  [R1206]  48.13 28.32 0 top
R39  20R  [R1206]  53.72 23.88 0 top
R42  20R  [R1206]  48.26 8.38 180 top
R43  20R  [R1206]  65.68 10.41 270 top
R44  20R  [R1206]  68.22 10.41 90 top
R45  20R  [R1206]  66.67 20.7 0 top
R46  68R  [R1206]  79.63 9.27 90 top
R47  20R  [R1206]  13.21 23.62 180 top
R48  20R  [R1206]  20.57 23.5 0 top
R49  20R  [R1206]  75.95 3.68 180 top
R50  5K  [R1206]  75.56 33.4 90 bottom
R51  68R  [R1206]  15.37 41.4 270 top
R52  68R  [R1206]  12.82 41.44 90 top
R54  10M  [RES-TH_BD3.3-L9.0-P13.00-D0.6]  47.12 2.79 0 top
R55  68R  [R1206]  33.02 41.28 270 top
R56  5K  [R1206]  48.26 7.86 180 bottom
R57  5K  [R1206]  48.23 10.42 0 bottom
R58  5K  [R1206]  48.26 15.49 180 bottom
R59  5K  [R1206]  48.39 20.45 180 bottom
RLY1  SRD-05VDC-SL-C  [RELAY-TH_SRD-XXVDC-XL-C]  15.64 8.99 0 top
RN1  750K  [RES-ARRAY-SMD_0603-8P-L3.2-W1.6-BL]  40.51 8.78 180 top
RN2  130K  [RES-ARRAY-SMD_0603-8P-L3.2-W1.6-BL]  40.51 13.23 180 top
RN3  13K  [RES-ARRAY-SMD_0603-8P-L3.2-W1.6-BL]  40.51 17.67 180 top
RN4  6K8  [RES-ARRAY-SMD_0603-8P-L3.2-W1.6-BL]  40.51 22.12 180 top
RN5  47R  [RES-ARRAY-SMD_0603-8P-L3.2-W1.6-BL]  65.79 25.4 90 top
SW1  5.8 ZSGT  [SW-TH_5.8ZSGT]  60.07 33.78 0 top
U1  CD4051BM/TR  [SOP-16_L9.9-W3.9-P1.27-LS6.1-BL]  60.05 23.21 90 top
U6  ADS1110A0IDBVR  [SOT-23-6_L2.9-W1.6-P0.95-LS2.8-BR]  72.01 19.69 180 top
U7  TL331IDBVR  [SOT-23-5_L3.0-W1.7-P0.95-LS2.8-BR]  72.26 11.81 270 top
U8  NE5532DR  [SOIC-8_L4.9-W3.9-P1.27-LS6.0-BL]  48.13 22.86 180 top
U9  NE5532DR  [SOIC-8_L4.9-W3.9-P1.27-LS6.0-BL]  48.19 13.62 0 top
U10  XRRH3.5*6.0*0.8  [IND-TH_BD3.5-L6.0-P10.00-D0.8]  32.26 2.79 0 top
U11  XRRH3.5*6.0*0.8  [IND-TH_BD3.5-L6.0-P10.00-D0.8]  32.13 7.87 0 top
U12  XRRH3.5*6.0*0.8  [IND-TH_BD3.5-L6.0-P10.00-D0.8]  43.43 15.49 270 bottom
U13  HT7133-1  [SOT-89_L4.5-W2.5-P1.50-LS4.2-BR]  65.09 52.76 90 top
U14  J175-D26Z  [TO-92-3_L4.9-W3.7-P2.54-L]  70.2 33.19 90 top
U15  LCKFB-DKX-STM32F103C8T6  [CONN-TH_L53.3-W22.9_STM32F103C8T6-CARD]  29.21 43.69 180 bottom

## Footprints (pads in the part's own frame, mm; a bottom-side part is the same pattern mirrored in y, then rotated)
BUZ-TH_BD9.0-P4.00-D0.6-FD
  round 1.8 hole 1: 1(-2,0) 2(2,0)
C1206
  rect 1.485x1.728 smd: 1(-1.593,0) 2(1.593,0)
CAP-TH_BD10.0-P5.00-D0.6-FD
  round 1.6 hole 1: 1(-2.5,0) 2(2.5,0)
CONN-TH_2P-P2.50_XH-2A_3045048
  rect 1.8x1.8 hole 1.1: 1(-1.25,0)
  round 1.8 hole 1.1: 2(1.25,0)
CONN-TH_L53.3-W22.9_STM32F103C8T6-CARD
  round 1.6 hole 1: 1(-24.13,-7.62) 2(-21.59,-7.62) 3(-19.05,-7.62) 4(-16.51,-7.62) 5(-13.97,-7.62) 6(-11.43,-7.62) 7(-8.89,-7.62) 8(-6.35,-7.62) 9(-3.81,-7.62) 10(-1.27,-7.62) 11(1.27,-7.62) 12(3.81,-7.62) 13(6.35,-7.62) 14(8.89,-7.62) 15(11.43,-7.62) 16(13.97,-7.62) 17(16.51,-7.62) 18(19.05,-7.62) 19(21.59,-7.62) 20(24.13,-7.62) 21(24.13,7.62) 22(21.59,7.62) 23(19.05,7.62) 24(16.51,7.62) 25(13.97,7.62) 26(11.43,7.62) 27(8.89,7.62) 28(6.35,7.62) 29(3.81,7.62) 30(1.27,7.62) 31(-1.27,7.62) 32(-3.81,7.62) 33(-6.35,7.62) 34(-8.89,7.62) 35(-11.43,7.62) 36(-13.97,7.62) 37(-16.51,7.62) 38(-19.05,7.62) 39(-21.59,7.62) 40(-24.13,7.62)
DO-35_BD2.0-L4.2-P8.20-D0.5-RD
  round 1.6 hole 0.8: 1(-4.1,0) 2(4.1,0)
FUSE-TH_BD4.0-L11.0-P15.00-D0.6
  round 1.8 hole 1: 1(-8,0) 2(8,0)
HDR-TH_8P-P2.54-V-F-R2-C4-S2.54
  rect 1.6x1.6 hole 1.1: 1(-3.81,-1.27)
  round 1.6 hole 1.1: 2(-3.81,1.27) 3(-1.27,-1.27) 4(-1.27,1.27) 5(1.27,-1.27) 6(1.27,1.27) 7(3.81,-1.27) 8(3.81,1.27)
IND-TH_BD3.5-L6.0-P10.00-D0.8
  round 1.6 hole 1: 1(-5,0) 2(5,0)
LED0805-R-RD
  rect 1x1.399 smd: 1(1.05,0) 2(-1.05,0)
R1206
  rect 1.208x1.701 smd: 1(-1.479,0) 2(1.479,0)
RELAY-TH_SRD-XXVDC-XL-C
  round 2.794 hole 1.524: 1(-5.1,-6) 2(7.1,-6) 3(7.1,6) 4(-5.1,6) 5(-7.1,0)
RES-ARRAY-SMD_0603-8P-L3.2-W1.6-BL
  rect 0.65x0.8 smd: 1(-1.2,-0.9) 4(1.2,-0.9) 5(1.2,0.9) 8(-1.2,0.9)
  rect 0.5x0.8 smd: 2(-0.4,-0.9) 3(0.4,-0.9) 6(0.4,0.9) 7(-0.4,0.9)
RES-TH_BD3.3-L9.0-P13.00-D0.6
  round 1.524 hole 0.914: 1(-6.5,0) 2(6.5,0)
rp
  round 2 hole 1: 1(2.5,-2.5) 2(0,2.5) 3(-2.5,-2.5)
SMA_L4.3-W2.6-LS5.2-FD
  rect 2.107x1.566 smd: 1(-2.386,0) 2(2.386,0)
SOIC-8_L4.9-W3.9-P1.27-LS6.0-BL
  oval 0.588x2.045 smd: 1(-1.905,-2.772) 2(-0.635,-2.772) 3(0.635,-2.772) 4(1.905,-2.772) 5(1.905,2.772) 6(0.635,2.772) 7(-0.635,2.772) 8(-1.905,2.772)
SOP-16_L9.9-W3.9-P1.27-LS6.1-BL
  oval 0.6x1.6 smd: 1(-4.445,-2.6) 2(-3.175,-2.6) 3(-1.905,-2.6) 4(-0.635,-2.6) 5(0.635,-2.6) 6(1.905,-2.6) 7(3.175,-2.6) 8(4.445,-2.6) 9(4.445,2.6) 10(3.175,2.6) 11(1.905,2.6) 12(0.635,2.6) 13(-0.635,2.6) 14(-1.905,2.6) 15(-3.175,2.6) 16(-4.445,2.6)
SOT-23-5_L3.0-W1.7-P0.95-LS2.8-BR
  rect 1.1x0.6 smd: 1(1.3,-0.95) 2(1.3,0) 3(1.3,0.95) 4(-1.3,0.95) 5(-1.3,-0.95)
SOT-23-6_L2.9-W1.6-P0.95-LS2.8-BR
  rect 1.1x0.6 smd: 1(1.35,-0.95) 2(1.35,0) 3(1.35,0.95) 4(-1.35,0.95) 5(-1.35,0) 6(-1.35,-0.95)
SOT-89_L4.5-W2.5-P1.50-LS4.2-BR
  rect 1.575x0.672 smd: 1(1.356,-1.5) 3(1.356,1.5)
  custom 5.377x1.9 smd: 2(-1.356,0.009)
SW-TH_5.8ZSGT
  rect 1.524x1.524 hole 1: 1(2,-2.25)
  round 1.524 hole 1: 2(0,-2.25) 3(-2,-2.25) 4(2,2.25) 5(0,2.25) 6(-2,2.25)
TO-92-3_L4.8-W3.7-P2.54-L
  rect 1.8x1.8 hole 1: 1(-2.54,0)
  round 1.8 hole 1: 2(0,0) 3(2.54,0)
TO-92-3_L4.9-W3.7-P2.54-L
  round 1.8 hole 1: 1(2.54,0) 2(0,0)
  rect 1.8x1.8 hole 1: 3(-2.54,0)

## Nets
As in the schematic.

Pads without a net: U15 1 2 3 4 8 20 21 22 23 24 25 35 36 39 40
